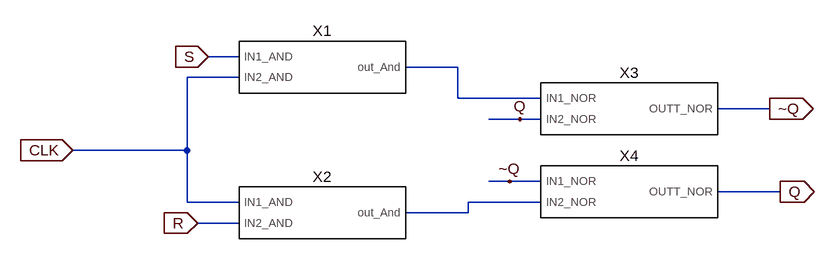
[diagram p0: schematic SRLatchh.asc]
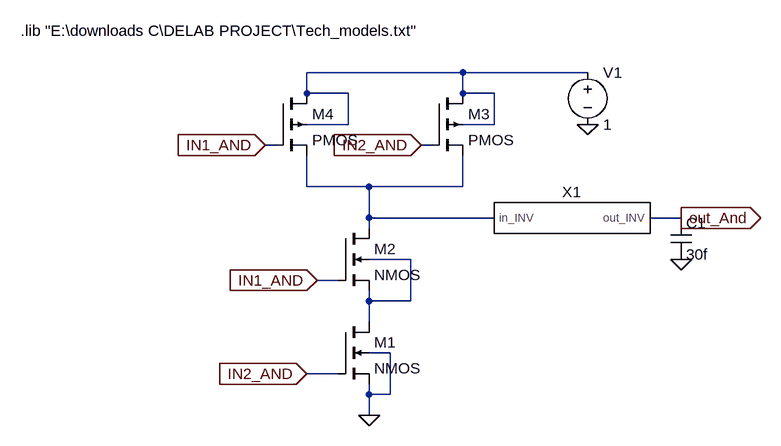
[diagram p1: sub-circuit gate_andd.asc]
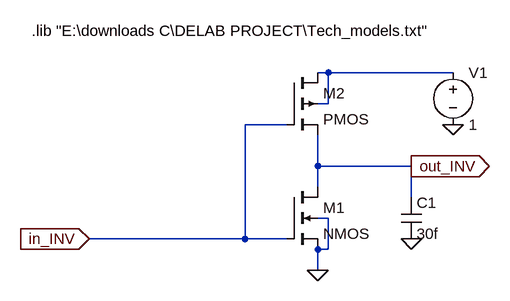
[diagram p2: sub-circuit gate_invv.asc]
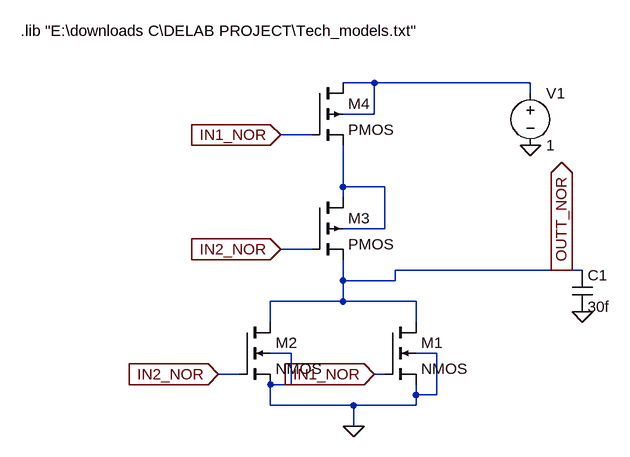
[diagram p3: sub-circuit gate_nor.asc]
SRLatchh.asc, the LTspice schematic file:
Version 4
SHEET 1 880 680
WIRE -48 64 -96 64
WIRE 288 80 208 80
WIRE -48 96 -128 96
WIRE 288 128 288 80
WIRE 416 128 288 128
WIRE 768 144 688 144
WIRE 384 160 336 160
WIRE 416 160 384 160
WIRE -128 208 -128 96
WIRE -128 208 -304 208
WIRE 368 256 336 256
WIRE 416 256 368 256
WIRE 784 272 688 272
WIRE -128 288 -128 208
WIRE -48 288 -128 288
WIRE 416 288 304 288
WIRE 304 304 304 288
WIRE 304 304 208 304
WIRE -48 320 -112 320
FLAG -96 64 S
IOPIN -96 64 In
FLAG -112 320 R
IOPIN -112 320 In
FLAG 768 144 ~Q
IOPIN 768 144 Out
FLAG 784 272 Q
IOPIN 784 272 Out
FLAG 384 160 Q
FLAG 368 256 ~Q
FLAG -304 208 CLK
IOPIN -304 208 In
SYMBOL gate_andd 80 80 R0
SYMATTR InstName X1
SYMBOL gate_andd 80 304 R0
SYMATTR InstName X2
SYMBOL gate_nor 544 144 R0
SYMATTR InstName X3
SYMBOL gate_nor 544 272 R0
SYMATTR InstName X4

gate_andd.asc, the sub-circuit schematic file:
Version 4
SHEET 1 880 680
WIRE 352 -160 112 -160
WIRE 544 -160 352 -160
WIRE 112 -128 112 -160
WIRE 176 -128 112 -128
WIRE 352 -128 352 -160
WIRE 400 -128 352 -128
WIRE 176 -80 176 -128
WIRE 176 -80 112 -80
WIRE 400 -80 400 -128
WIRE 400 -80 352 -80
WIRE 64 -48 48 -48
WIRE 304 -48 288 -48
WIRE 112 16 112 -32
WIRE 208 16 112 16
WIRE 352 16 352 -32
WIRE 352 16 208 16
WIRE 208 64 208 16
WIRE 400 64 208 64
WIRE 688 64 640 64
WIRE 208 80 208 64
WIRE 272 128 208 128
WIRE 160 160 128 160
WIRE 208 192 208 176
WIRE 272 192 272 128
WIRE 272 192 208 192
WIRE 208 224 208 192
WIRE 240 272 208 272
WIRE 160 304 112 304
WIRE 208 336 208 320
WIRE 240 336 240 272
WIRE 240 336 208 336
WIRE 208 368 208 336
FLAG 208 368 0
FLAG 544 -80 0
FLAG 48 -48 IN1_AND
IOPIN 48 -48 In
FLAG 288 -48 IN2_AND
IOPIN 288 -48 In
FLAG 688 128 0
FLAG 688 64 out_And
IOPIN 688 64 Out
FLAG 128 160 IN1_AND
IOPIN 128 160 In
FLAG 112 304 IN2_AND
IOPIN 112 304 In
SYMBOL nmos4 160 224 R0
SYMATTR InstName M1
SYMATTR Value2 l=32n w=64n
SYMBOL nmos4 160 80 R0
SYMATTR InstName M2
SYMATTR Value2 l=32n w=64n
SYMBOL pmos4 304 -128 R0
SYMATTR InstName M3
SYMATTR Value2 l=32n w=128n
SYMBOL pmos4 64 -128 R0
SYMATTR InstName M4
SYMATTR Value2 l=32n w=128n
SYMBOL voltage 544 -176 R0
WINDOW 123 0 0 Left 0
WINDOW 39 0 0 Left 0
SYMATTR InstName V1
SYMATTR Value 1
SYMBOL gate_invv 512 64 R0
SYMATTR InstName X1
SYMBOL cap 672 64 R0
SYMATTR InstName C1
SYMATTR Value 30f
TEXT -328 -224 Left 2 !.lib "E:\\downloads C\\DELAB PROJECT\\Tech_models.txt"

gate_invv.asc, the sub-circuit schematic file:
Version 4
SHEET 1 880 680
WIRE 240 32 224 32
WIRE 432 32 240 32
WIRE 240 80 240 32
WIRE 240 80 224 80
WIRE 176 112 112 112
WIRE 224 176 224 128
WIRE 368 176 224 176
WIRE 224 208 224 176
WIRE 368 224 368 176
WIRE 240 256 224 256
WIRE 112 288 112 112
WIRE 112 288 -128 288
WIRE 176 288 112 288
WIRE 240 304 240 256
WIRE 240 304 224 304
WIRE 224 336 224 304
FLAG 224 336 0
FLAG 432 112 0
FLAG -128 288 in_INV
IOPIN -128 288 In
FLAG 368 176 out_INV
IOPIN 368 176 Out
FLAG 368 288 0
SYMBOL nmos4 176 208 R0
SYMATTR InstName M1
SYMATTR Value2 l=32n w=64n
SYMBOL pmos4 176 32 R0
SYMATTR InstName M2
SYMATTR Value2 l=32n w=128n
SYMBOL voltage 432 16 R0
WINDOW 123 0 0 Left 0
WINDOW 39 0 0 Left 0
SYMATTR InstName V1
SYMATTR Value 1
SYMBOL cap 352 224 R0
SYMATTR InstName C1
SYMATTR Value 30f
TEXT -216 -32 Left 2 !.lib "E:\\downloads C\\DELAB PROJECT\\Tech_models.txt"

gate_nor.asc, the sub-circuit schematic file:
Version 4
SHEET 1 880 680
WIRE 224 -176 176 -176
WIRE 464 -176 224 -176
WIRE 464 -160 464 -176
WIRE 224 -128 224 -176
WIRE 224 -128 176 -128
WIRE 128 -96 80 -96
WIRE 176 -16 176 -80
WIRE 240 -16 176 -16
WIRE 176 0 176 -16
WIRE 240 48 240 -16
WIRE 240 48 176 48
WIRE 128 80 80 80
WIRE 512 112 256 112
WIRE 544 112 512 112
WIRE 176 128 176 96
WIRE 256 128 256 112
WIRE 256 128 176 128
WIRE 176 160 176 128
WIRE 176 160 64 160
WIRE 288 160 176 160
WIRE 64 192 64 160
WIRE 288 192 288 160
WIRE 96 240 64 240
WIRE 320 240 288 240
WIRE 16 272 -16 272
WIRE 240 272 224 272
WIRE 96 288 96 240
WIRE 96 288 64 288
WIRE 288 304 288 288
WIRE 320 304 320 240
WIRE 320 304 288 304
WIRE 64 320 64 288
WIRE 192 320 64 320
WIRE 288 320 288 304
WIRE 288 320 192 320
WIRE 192 352 192 320
FLAG 192 352 0
FLAG 464 -80 0
FLAG 544 176 0
FLAG 80 -96 IN1_NOR
IOPIN 80 -96 In
FLAG 224 272 IN1_NOR
IOPIN 224 272 In
FLAG 80 80 IN2_NOR
IOPIN 80 80 In
FLAG -16 272 IN2_NOR
IOPIN -16 272 In
FLAG 512 112 OUTT_NOR
IOPIN 512 112 Out
SYMBOL nmos4 240 192 R0
SYMATTR InstName M1
SYMATTR Value2 l=32n w=64n
SYMBOL nmos4 16 192 R0
SYMATTR InstName M2
SYMATTR Value2 l=32n w=64n
SYMBOL pmos4 128 0 R0
SYMATTR InstName M3
SYMATTR Value2 l=32n w=128n
SYMBOL pmos4 128 -176 R0
SYMATTR InstName M4
SYMATTR Value2 l=32n w=128n
SYMBOL voltage 464 -176 R0
WINDOW 123 0 0 Left 0
WINDOW 39 0 0 Left 0
SYMATTR InstName V1
SYMATTR Value 1
SYMBOL cap 528 112 R0
SYMATTR InstName C1
SYMATTR Value 30f
TEXT -320 -256 Left 2 !.lib "E:\\downloads C\\DELAB PROJECT\\Tech_models.txt"

The netlist it stands for:
* SRLatchh.asc
XX1 S CLK N001 gate_andd
XX2 CLK R N002 gate_andd
XX3 N001 Q ~Q gate_nor
XX4 ~Q N002 Q gate_nor

* block symbol definitions
.subckt gate_andd IN1_AND IN2_AND out_And
M1 N003 IN2_AND 0 0 NMOS l=32n w=64n
M2 N002 IN1_AND N003 N003 NMOS l=32n w=64n
M3 N001 IN2_AND N002 N001 PMOS l=32n w=128n
M4 N001 IN1_AND N002 N001 PMOS l=32n w=128n
V1 N001 0 1
XX1 N002 out_And gate_invv
C1 out_And 0 30f
.lib "E:\downloads C\DELAB PROJECT\Tech_models.txt"
.ends gate_andd

.subckt gate_invv in_INV out_INV
M1 out_INV in_INV 0 0 NMOS l=32n w=64n
M2 N001 in_INV out_INV N001 PMOS l=32n w=128n
V1 N001 0 1
C1 out_INV 0 30f
.lib "E:\downloads C\DELAB PROJECT\Tech_models.txt"
.ends gate_invv

.subckt gate_nor IN1_NOR IN2_NOR OUTT_NOR
M1 OUTT_NOR IN1_NOR 0 0 NMOS l=32n w=64n
M2 OUTT_NOR IN2_NOR 0 0 NMOS l=32n w=64n
M3 N002 IN2_NOR OUTT_NOR N002 PMOS l=32n w=128n
M4 N001 IN1_NOR N002 N001 PMOS l=32n w=128n
V1 N001 0 1
C1 OUTT_NOR 0 30f
.lib "E:\downloads C\DELAB PROJECT\Tech_models.txt"
.ends gate_nor

.model NMOS NMOS
.model PMOS PMOS
.lib standard.mos
.backanno
.end